# Altium schematic sheet Audio-Beamformer_RaspberryPi_V1.0.SchDoc: Audio-Beamformer
size A4; PageSetup: Record=PageOptions|CenterHorizontal=True|CenterVertical=True|PrintScale=0.97|XCorrection=1.00|YCorrection=1.00|PrintKind=0|BorderSize=5000000|LeftOffset=0|BottomOffset=0|Orientation=2|PaperLength=1000|PaperWidth=1000|Scale=100|PaperSource=7|PrintQuality=-3|MediaType=1|DitherType=10|PrintScaleMode=1|PaperKind=A4|PaperIndex=9; Organization: Ostschweizer Fachhochschule; Address2: Florian Baumgartner & Thierry Schwaller; Address3: florian.baumgartner@ost.ch; DocumentNumber: 3; Revision: V1.0; SheetNumber: 3; SheetTotal: 10; Author: Florian Baumgartner & Thierry Schwaller; Subtitle: Raspberry Pi Compute Module 4
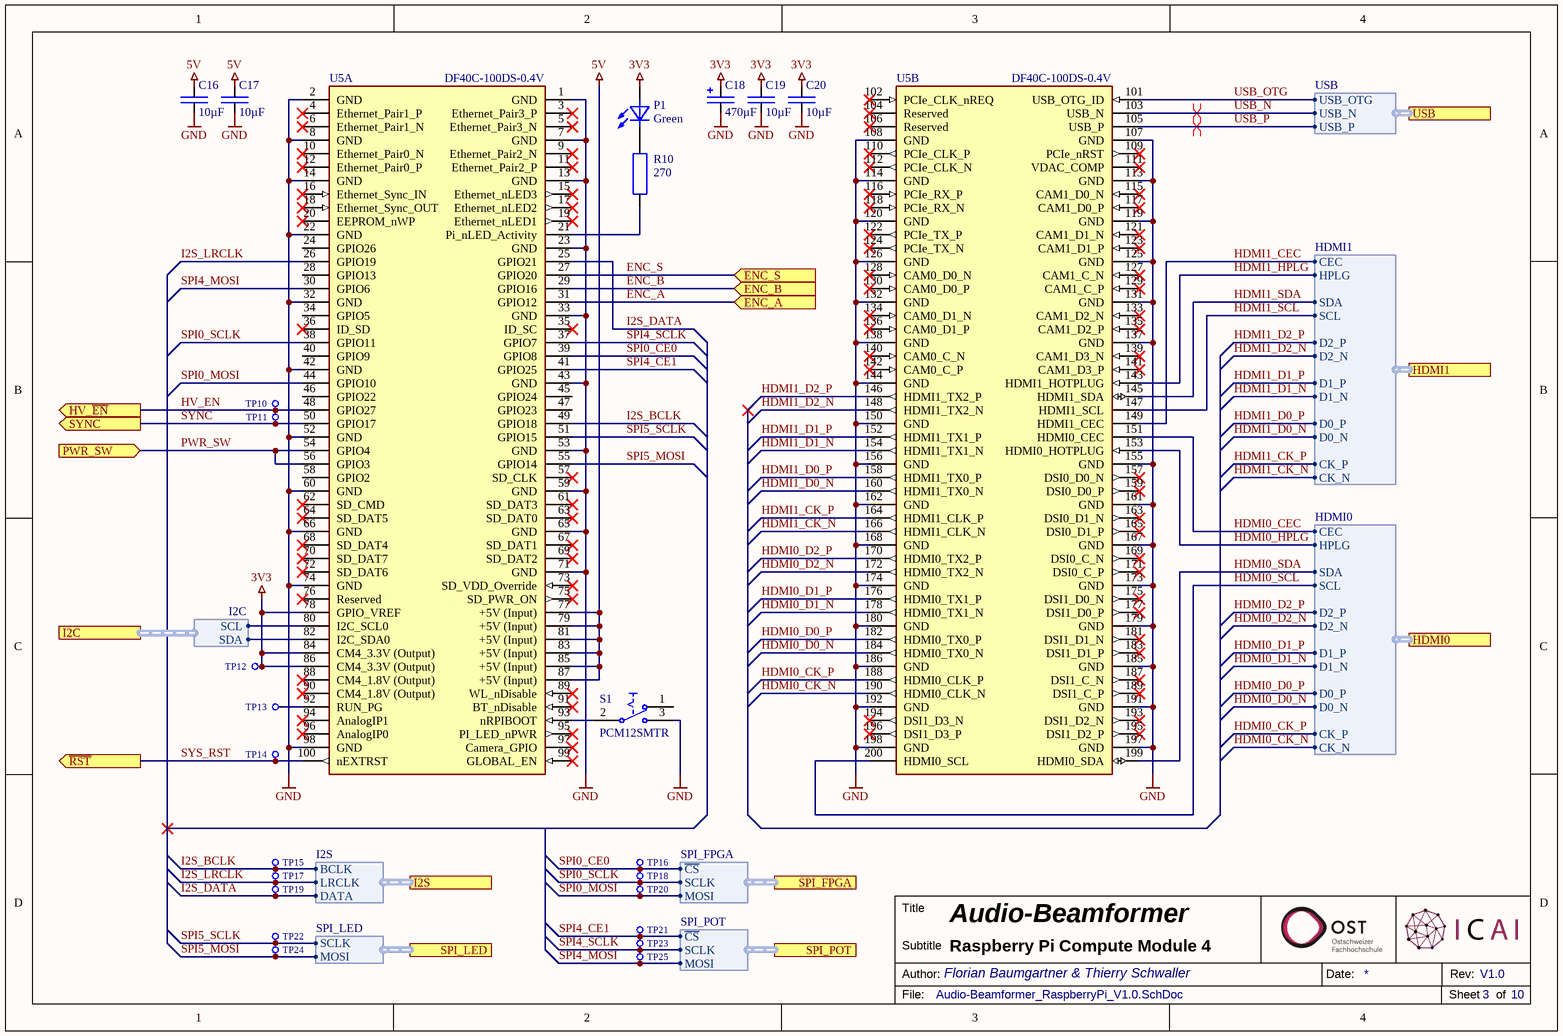
[diagram p0: Audio-Beamformer_RaspberryPi_V1.0.SchDoc]

## Parts
C16  10µF  [SMD Keramikkondensator 1206]
C17  10µF  [SMD Keramikkondensator 1206]
C18  470µF  [SMD Elko 10.0x10.0]
C19  10µF  [SMD Keramikkondensator 1206]
C20  10µF  [SMD Keramikkondensator 1206]
P1  Green  [SMD LED 0603]
R10  270  [SMD Widerstand 0603]
S1  PCM12SMTR  [SMD Switch SPDT (PCM12SMTR)]
TP10  X-TP  [THT Testpunkt Ø1mm]  (value not drawn)  (no BOM)
TP11  X-TP  [THT Testpunkt Ø1mm]  (value not drawn)  (no BOM)
TP12  X-TP  [THT Testpunkt Ø1mm]  (value not drawn)  (no BOM)
TP13  X-TP  [THT Testpunkt Ø1mm]  (value not drawn)  (no BOM)
TP14  X-TP  [THT Testpunkt Ø1mm]  (value not drawn)  (no BOM)
TP15  X-TP  [THT Testpunkt Ø1mm]  (value not drawn)  (no BOM)
TP16  X-TP  [THT Testpunkt Ø1mm]  (value not drawn)  (no BOM)
TP17  X-TP  [THT Testpunkt Ø1mm]  (value not drawn)  (no BOM)
TP18  X-TP  [THT Testpunkt Ø1mm]  (value not drawn)  (no BOM)
TP19  X-TP  [THT Testpunkt Ø1mm]  (value not drawn)  (no BOM)
TP20  X-TP  [THT Testpunkt Ø1mm]  (value not drawn)  (no BOM)
TP21  X-TP  [THT Testpunkt Ø1mm]  (value not drawn)  (no BOM)
TP22  X-TP  [THT Testpunkt Ø1mm]  (value not drawn)  (no BOM)
TP23  X-TP  [THT Testpunkt Ø1mm]  (value not drawn)  (no BOM)
TP24  X-TP  [THT Testpunkt Ø1mm]  (value not drawn)  (no BOM)
TP25  X-TP  [THT Testpunkt Ø1mm]  (value not drawn)  (no BOM)
U5  DF40C-100DS-0.4V  [SMD CM4-F40C-100DS-0.4v_1.5mm]  (parts A,B of 2)

## Ports
ENC_A (in), ENC_B (in), ENC_S (in), HDMI0 (harness HDMI0), HDMI1 (harness HDMI1), HV_~{EN} (out), I2C (harness I2C), I2S (harness I2S), PWR_SW (in), SPI_FPGA (harness SPI_FPGA), SPI_LED (harness SPI_LED), SPI_POT (harness SPI_POT), SYNC (out), USB (harness USB), ~{RST} (out)

## Harnesses
USB: USB_N, USB_P, USB_OTG
HDMI0: D2_N, D1_P, D2_P, D1_N, D0_P, D0_N, CK_N, CK_P, CEC, SCL, SDA, HPLG
HDMI1: D2_N, D1_P, D2_P, D1_N, D0_P, D0_N, CK_N, CK_P, CEC, SCL, SDA, HPLG
I2C: SCL, SDA
SPI_LED: SCLK, MOSI
I2S: BCLK, LRCLK, DATA
SPI_FPGA: SCLK, MOSI, ~{CS}
SPI_POT: SCLK, MOSI, ~{CS}

## Nets
3V3: C18.P(+) C19.2 C20.2 P1.A TP12.1 U5.78(GPIO_VREF) U5.84(CM4_3.3V_(Output)) U5.86(CM4_3.3V_(Output))
5V: C16.2 C17.2 U5.77(+5V_(Input)) U5.79(+5V_(Input)) U5.81(+5V_(Input)) U5.83(+5V_(Input)) U5.85(+5V_(Input)) U5.87(+5V_(Input))
GND: C16.1 C17.1 C18.M(-) C19.1 C20.1 S1.3(NO1) U5.1(GND) U5.2(GND) U5.7(GND) U5.8(GND) U5.13(GND) U5.14(GND) U5.22(GND) U5.23(GND) U5.32(GND) U5.33(GND) U5.42(GND) U5.43(GND) U5.52(GND) U5.53(GND) U5.59(GND) U5.60(GND) U5.65(GND) U5.66(GND) U5.71(GND) U5.74(GND) U5.98(GND) U5.107(GND) U5.108(GND) U5.113(GND) U5.114(GND) U5.119(GND) U5.120(GND) U5.125(GND) U5.126(GND) U5.131(GND) U5.132(GND) U5.137(GND) U5.138(GND) U5.144(GND) U5.150(GND) U5.155(GND) U5.156(GND) U5.161(GND) U5.162(GND) U5.167(GND) U5.168(GND) U5.173(GND) U5.174(GND) U5.179(GND) U5.180(GND) U5.185(GND) U5.186(GND) U5.191(GND) U5.192(GND) U5.197(GND) U5.198(GND)
ENC_A: U5.31(GPIO12) ; port ENC_A
ENC_B: U5.29(GPIO16) ; port ENC_B
ENC_S: U5.27(GPIO20) ; port ENC_S
HDMI0_CEC: U5.151(HDMI0_CEC) ; port HDMI0.CEC
HDMI0_CK_N: U5.190(HDMI0_CLK_N) ; port HDMI0.CK_N
HDMI0_CK_P: U5.188(HDMI0_CLK_P) ; port HDMI0.CK_P
HDMI0_D0_N: U5.184(HDMI0_TX0_N) ; port HDMI0.D0_N
HDMI0_D0_P: U5.182(HDMI0_TX0_P) ; port HDMI0.D0_P
HDMI0_D1_N: U5.178(HDMI0_TX1_N) ; port HDMI0.D1_N
HDMI0_D1_P: U5.176(HDMI0_TX1_P) ; port HDMI0.D1_P
HDMI0_D2_N: U5.172(HDMI0_TX2_N) ; port HDMI0.D2_N
HDMI0_D2_P: U5.170(HDMI0_TX2_P) ; port HDMI0.D2_P
HDMI0_HPLG: U5.153(HDMI0_HOTPLUG) ; port HDMI0.HPLG
HDMI0_SCL: U5.200(HDMI0_SCL) ; port HDMI0.SCL
HDMI0_SDA: U5.199(HDMI0_SDA) ; port HDMI0.SDA
HDMI1_CEC: U5.149(HDMI1_CEC) ; port HDMI1.CEC
HDMI1_CK_N: U5.166(HDMI1_CLK_N) ; port HDMI1.CK_N
HDMI1_CK_P: U5.164(HDMI1_CLK_P) ; port HDMI1.CK_P
HDMI1_D0_N: U5.160(HDMI1_TX0_N) ; port HDMI1.D0_N
HDMI1_D0_P: U5.158(HDMI1_TX0_P) ; port HDMI1.D0_P
HDMI1_D1_N: U5.154(HDMI1_TX1_N) ; port HDMI1.D1_N
HDMI1_D1_P: U5.152(HDMI1_TX1_P) ; port HDMI1.D1_P
HDMI1_D2_N: U5.148(HDMI1_TX2_N) ; port HDMI1.D2_N
HDMI1_D2_P: U5.146(HDMI1_TX2_P) ; port HDMI1.D2_P
HDMI1_HPLG: U5.143(HDMI1_HOTPLUG) ; port HDMI1.HPLG
HDMI1_SCL: U5.147(HDMI1_SCL) ; port HDMI1.SCL
HDMI1_SDA: U5.145(HDMI1_SDA) ; port HDMI1.SDA
HV_EN: TP10.1 U5.48(GPIO27) ; port HV_~{EN}
I2S_BCLK: TP15.1 U5.49(GPIO18) ; port I2S.BCLK
I2S_DATA: TP19.1 U5.25(GPIO21) ; port I2S.DATA
I2S_LRCLK: TP17.1 U5.26(GPIO19) ; port I2S.LRCLK
PWR_SW: U5.54(GPIO4) U5.56(GPIO3) ; port PWR_SW
SPI0_CE0: TP16.1 U5.39(GPIO8) ; port SPI_FPGA.~{CS}
SPI0_MOSI: TP20.1 U5.44(GPIO10) ; port SPI_FPGA.MOSI
SPI0_SCLK: TP18.1 U5.38(GPIO11) ; port SPI_FPGA.SCLK
SPI4_CE1: TP21.1 U5.41(GPIO25) ; port SPI_POT.~{CS}
SPI4_MOSI: TP25.1 U5.30(GPIO6) ; port SPI_POT.MOSI
SPI4_SCLK: TP23.1 U5.37(GPIO7) ; port SPI_POT.SCLK
SPI5_MOSI: TP24.1 U5.55(GPIO14) ; port SPI_LED.MOSI
SPI5_SCLK: TP22.1 U5.51(GPIO15) ; port SPI_LED.SCLK
SYNC: TP11.1 U5.50(GPIO17) ; port SYNC
SYS_RST: TP14.1 U5.100(nEXTRST) ; port ~{RST}
USB_N: U5.103(USB_N) ; port USB.USB_N
USB_OTG: U5.101(USB_OTG_ID) ; port USB.USB_OTG
USB_P: U5.105(USB_P) ; port USB.USB_P
NetP1_K: P1.K R10.1
NetR10_2: R10.2 U5.21(Pi_nLED_Activity)
NetS1_2: S1.2(COMMON1) U5.93(nRPIBOOT)
NetTP13_1: TP13.1 U5.92(RUN_PG)
NetU5_80: U5.80(I2C_SCL0) ; port I2C.SCL
NetU5_82: U5.82(I2C_SDA0) ; port I2C.SDA

Not connected (* = marked no-connect by the designer): S1 1(NC1); U5 3(Ethernet_Pair3_P)* 4(Ethernet_Pair1_P)* 5(Ethernet_Pair3_N)* 6(Ethernet_Pair1_N)* 9(Ethernet_Pair2_N)* 10(Ethernet_Pair0_N)* 11(Ethernet_Pair2_P)* 12(Ethernet_Pair0_P)* 15(Ethernet_nLED3)* 16(Ethernet_Sync_IN)* 17(Ethernet_nLED2)* 18(Ethernet_Sync_OUT)* 19(Ethernet_nLED1)* 20(EEPROM_nWP)* 24(GPIO26) 28(GPIO13) 34(GPIO5) 35(ID_SC)* 36(ID_SD)* 40(GPIO9) 45(GPIO24) 46(GPIO22) 47(GPIO23) 57(SD_CLK)* 58(GPIO2) 61(SD_DAT3)* 62(SD_CMD)* 63(SD_DAT0)* 64(SD_DAT5)* 67(SD_DAT1)* 68(SD_DAT4)* 69(SD_DAT2)* 70(SD_DAT7)* 72(SD_DAT6)* 73(SD_VDD_Override)* 75(SD_PWR_ON)* 76(Reserved)* 88(CM4_1.8V_(Output))* 89(WL_nDisable)* 90(CM4_1.8V_(Output))* 91(BT_nDisable)* 94(AnalogIP1)* 95(PI_LED_nPWR)* 96(AnalogIP0)* 97(Camera_GPIO)* 99(GLOBAL_EN)* 102(PCIe_CLK_nREQ)* 104(Reserved)* 106(Reserved)* 109(PCIe_nRST)* 110(PCIe_CLK_P)* 111(VDAC_COMP)* 112(PCIe_CLK_N)* 115(CAM1_D0_N)* 116(PCIe_RX_P)* 117(CAM1_D0_P)* 118(PCIe_RX_N)* 121(CAM1_D1_N)* 122(PCIe_TX_P)* 123(CAM1_D1_P)* 124(PCIe_TX_N)* 127(CAM1_C_N)* 128(CAM0_D0_N)* 129(CAM1_C_P)* 130(CAM0_D0_P)* 133(CAM1_D2_N)* 134(CAM0_D1_N)* 135(CAM1_D2_P)* 136(CAM0_D1_P)* 139(CAM1_D3_N)* 140(CAM0_C_N)* 141(CAM1_D3_P)* 142(CAM0_C_P)* 157(DSI0_D0_N)* 159(DSI0_D0_P)* 163(DSI0_D1_N)* 165(DSI0_D1_P)* 169(DSI0_C_N)* 171(DSI0_C_P)* 175(DSI1_D0_N)* 177(DSI1_D0_P)* 181(DSI1_D1_N)* 183(DSI1_D1_P)* 187(DSI1_C_N)* 189(DSI1_C_P)* 193(DSI1_D2_N)* 194(DSI1_D3_N)* 195(DSI1_D2_P)* 196(DSI1_D3_P)*

## Layout directives
differential pair: USB_N, USB_P

## Notes on the sheet
- Title
- Author:
- Subtitle
- Date:
- Rev:
- File:
- Sheet
- of

## Library data of the parts
C16 C17 C19 C20 = C-CAPACITOR: CAP-MK; Component Description: Multilayer Ceramic Capacitors; Component Value: 10µF 50V; Digikey: 445-7886-1-ND; Farnell: 2211092; Mouser: 810-CGA5L3X5R1H106K; JLC-Parts: C13585; Unit Price: 0.27
C18 = C-ELCAP: CAP-Elko; Component Description: Electrolytic Capacitor; Component Value: 470µF 25V; Mouser: 140-VEJ471M1ETR1010; JLC-Parts: C176672; Unit Price: 0.17
P1 = LED Green 0603: General Purpose LED; Component Value: Green (5mA, 2.4V); Digikey: 350-2035-1-ND; Farnell: 1465991; Mouser: 645-598-8070-107F; Unit Price: 0.34; ComponentLink1Description: Datasheet; ComponentLink1URL: https://datasheet.lcsc.com/szlcsc/Everlight-Elec-19-217-GHC-YR1S2-3T_C72043.pdf; JLC-Parts: C72043; Component Description: General Purpose LED
R10 = R-RESISTOR: SMD-Widerstand 1/4W; Component Description: Thick Film Chip Resistor; Component Value: 270 (75V, 100mW, 1%); Digikey: P270HCT-ND; Farnell: 2303096; Mouser: 667-ERJ-3EKF2700V; JLC-Parts: C22966; Unit Price: 0.06
S1 = S-PCM12SMTR: Miniature Slide Switch; aliExpress: 33002042977; Component Value: PCM12SMTR (SPDT); Digikey: 401-2016-1-ND; Mouser: 611-PCM12SMTR; Farnell: 9575146; JLC-Parts: C221841; Component Description: Miniature Slide Switch; Unit Price: 0.77
TP10-TP25 = X-TP: Testpunkt; Component Description: Testpoint; Component Value: Ø 0.8mm; Unit Price: 0.00
U5 = U-CM4: Board-To-Board Connector; ComponentLink1Description: Datasheet; ComponentLink1URL: https://www.farnell.com/datasheets/2691051.pdf; Digikey: H11615CT-ND; Component Value: DF40C-100DS-0.4V; Farnell: 2427679; JLC-Parts: C597931; Mouser: 798-DF40C100DS0.4V51; Unit Price: 1.59; Component Description: Board-To-Board Connector